# EasyEDA schematic Schematics.json
TITLE: Esp32 Radar Scanner; REV: 1.0; Date: 2026-01-19; Sheet: 1/1; Drawn By: mohammadsarfaraz
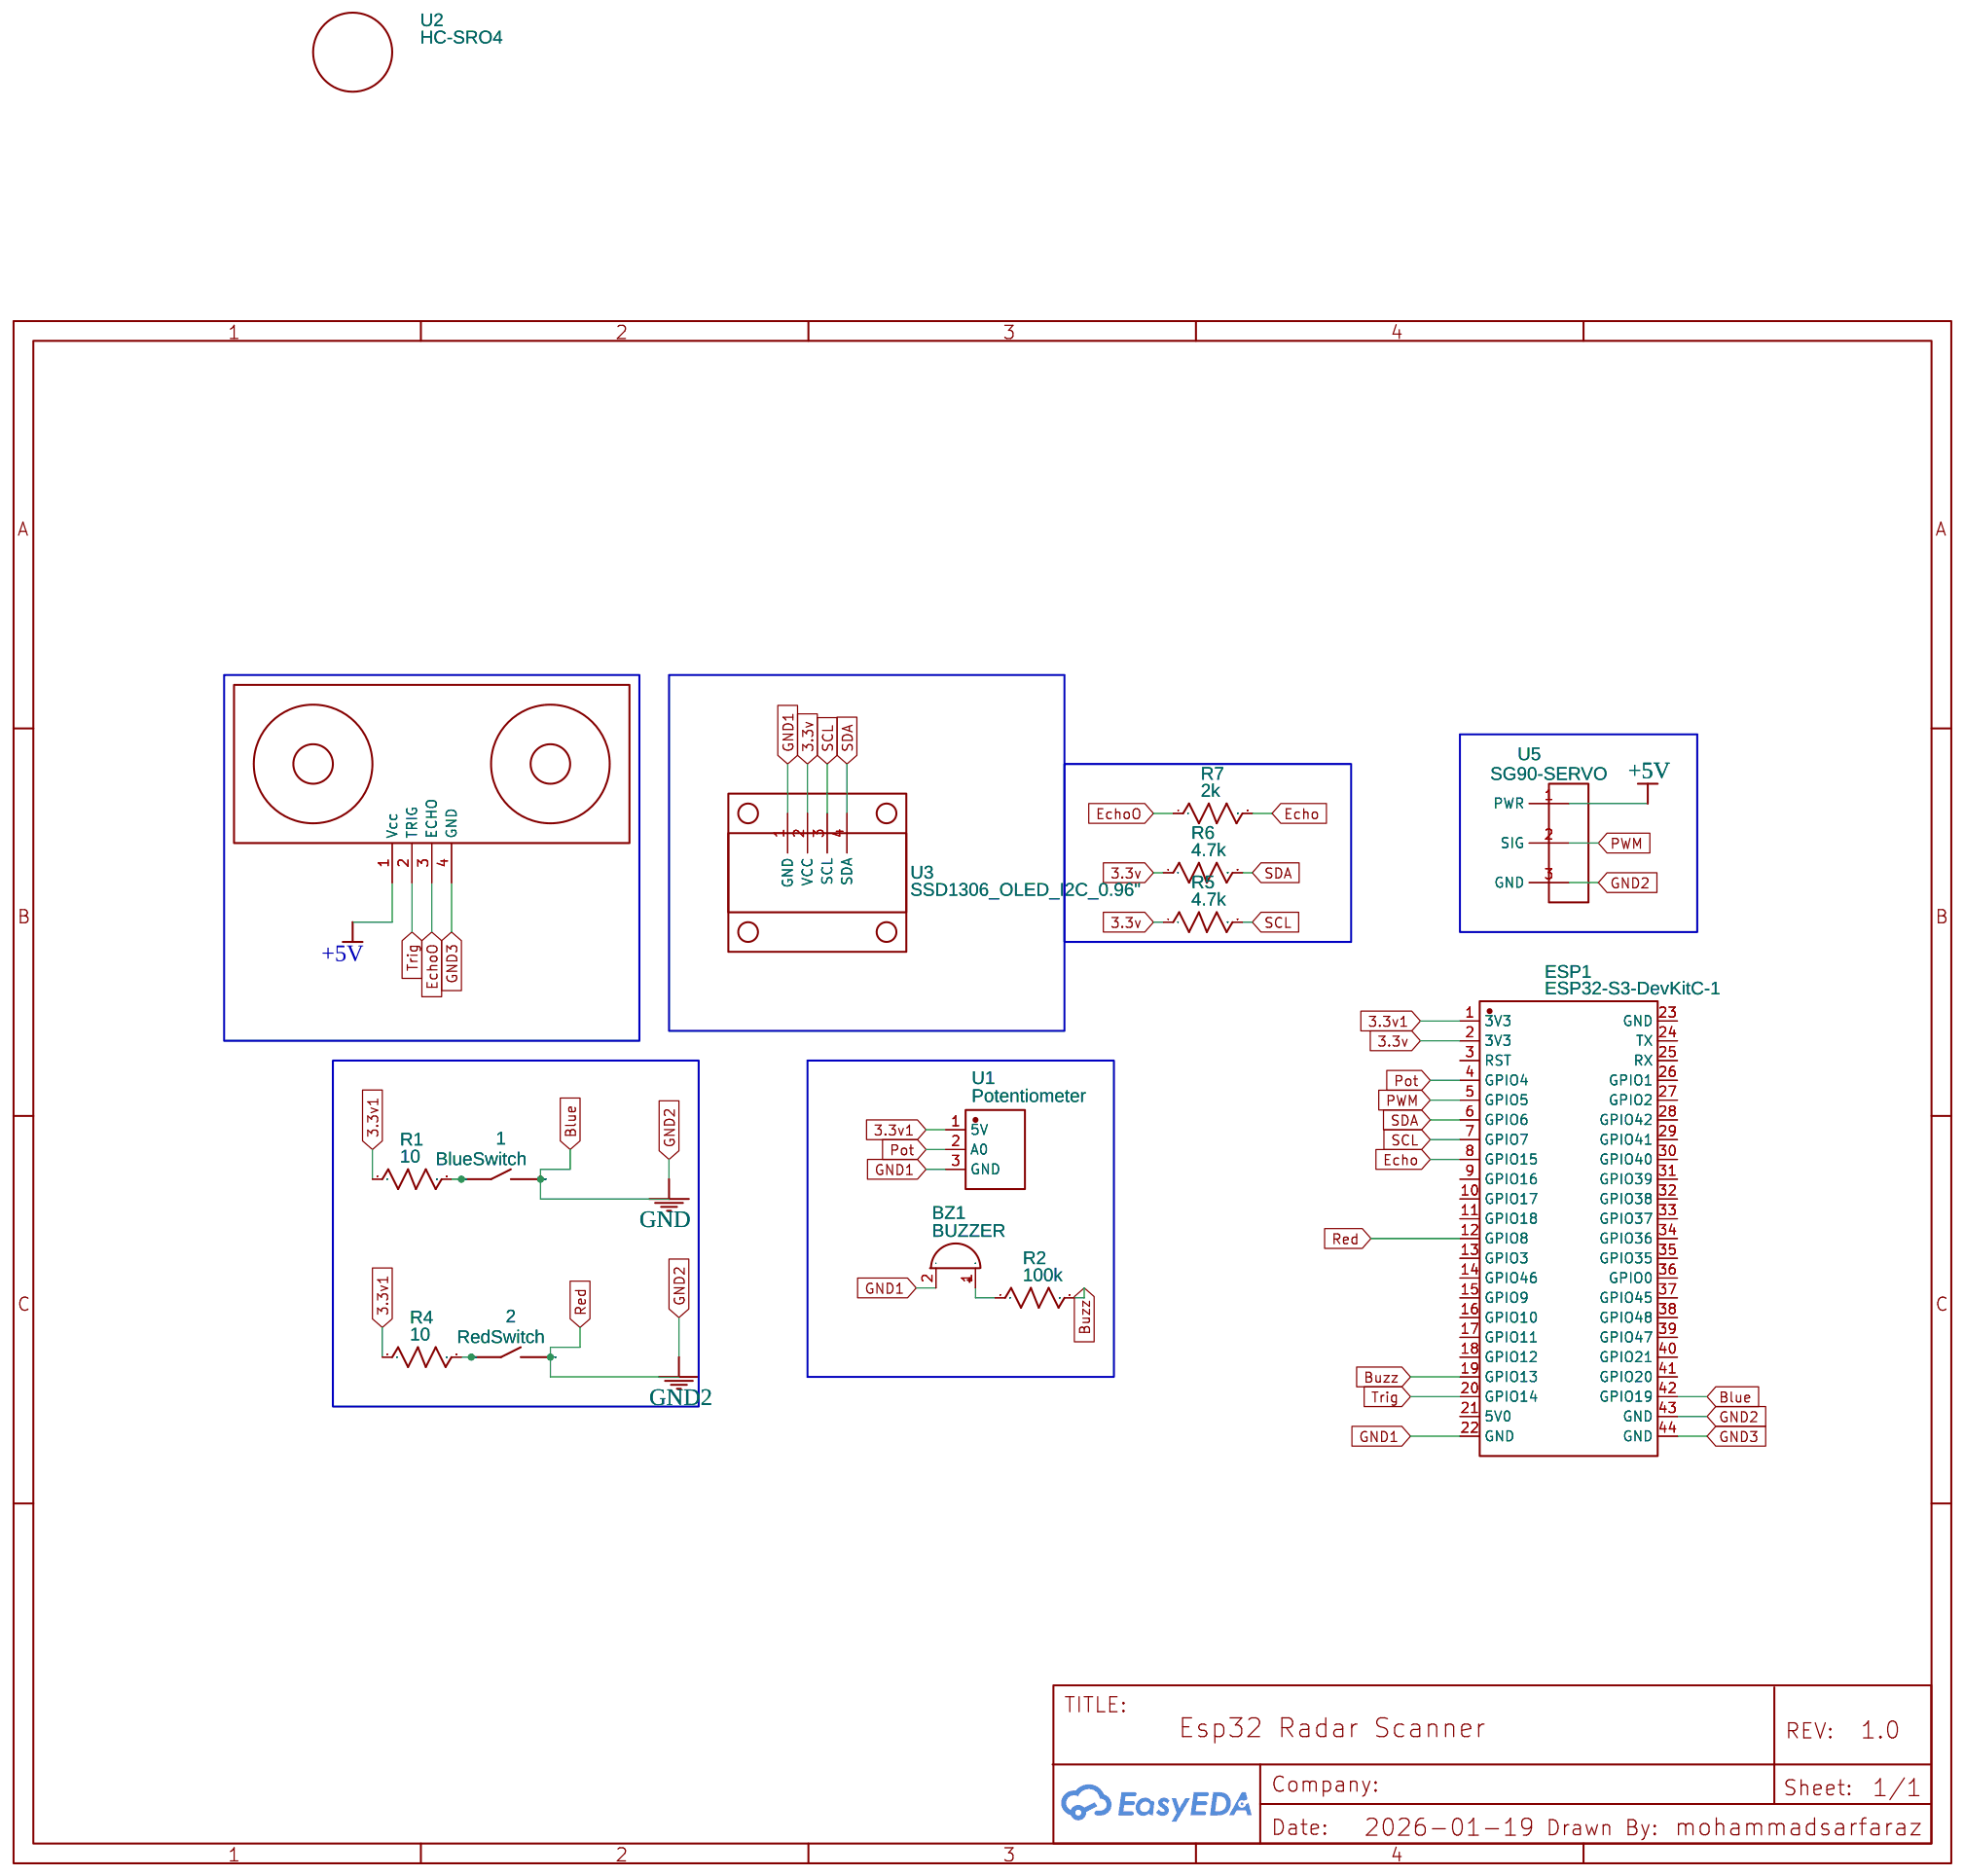
[diagram p0: schematic sheet]

## Parts
1  BlueSwitch  [SMD-4.5X4.5-TACTILE-PUSH-BUTTON]
2  RedSwitch  [SMD-4.5X4.5-TACTILE-PUSH-BUTTON]
BZ1  BUZZER  [BUZZER_BEEPER:BUZZER_12X9.5RM7.6]
ESP1  ESP32-S3-DevKitC-1  [ESP32-S3-DEVKITC-1]
R1  10  [R0603]
R2  100k  [R0603]
R4  10  [R0603]
R5  4.7k  [R0603]
R6  4.7k  [R0603]
R7  2k  [R0603]
U1  Potentiometer  [POTENTIOMETER10K]
U2  HC-SRO4
U3  SSD1306_OLED_I2C_0.96"  [SSD1306_OLED_I2C_0.96"]
U5  SG90-SERVO  [SG90-SERVO]

## Library data of the parts
1 2 = 4.5X4.5-SMD-TACTILE-SWITCH: Contributor: Aman Verma
BZ1 = BUZZER 12X9.5 FATHBOARD: Symbol: Device_Buzzer; Device: Device_Buzzer; Add into BOM: yes; Convert to PCB: yes; Origin Footprint: Buzzer_Beeper:Buzzer_12x9.5RM7.6; Contributor: myboomybott
ESP1 = ESP32-S3-DevKitC-1: Contributor: jrbynum
R1 R2 R4-R7 = R_0603_US: Contributor: LCEDA_Lib
U1 = Potentiometer: Contributor: eileen03
U2 = HC-SRO4: Contributor: lusc23067
U3 = SSD1306_OLED_I2C_0.96": Contributor: peterch84
U5 = SG90-SERVO: Contributor: theonegareth

## Nets
3.3v: ESP1.2(3V3) R5.1 R6.1 U3.2(VCC)
3.3v1: ESP1.1(3V3) R1.1 R4.1 U1.1(5V)
+5V: U2.1(Vcc) U5.1(PWR)
GND: ESP1.43(GND) U5.3(GND)
GND1: BZ1.2(-) ESP1.22(GND) U1.3(GND) U3.1(GND)
GND3: ESP1.44(GND) U2.4(GND)
Blue: 1.2.1(S2) 1.2.2(S2) ESP1.42(GPIO19)
Buzz: ESP1.19(GPIO13) R2.2
Echo: ESP1.8(GPIO15) R7.2
EchoO: R7.1 U2.3(ECHO)
Pot: ESP1.4(GPIO4) U1.2(A0)
PWM: ESP1.5(GPIO5) U5.2(SIG)
Red: 2.2.1(S2) 2.2.2(S2) ESP1.12(GPIO8)
SCL: ESP1.7(GPIO7) R5.2 U3.3(SCL)
SDA: ESP1.6(GPIO6) R6.2 U3.4(SDA)
Trig: ESP1.20(GPIO14) U2.2(TRIG)
Net-(1-1.1): 1.1.1(S1) 1.1.2(S1) R1.2
Net-(2-1.1): 2.1.1(S1) 2.1.2(S1) R4.2
Net-(BZ1-1): BZ1.1(+) R2.1

Not connected (* = marked no-connect by the designer): ESP1 3(RST) 9(GPIO16) 10(GPIO17) 11(GPIO18) 13(GPIO3) 14(GPIO46) 15(GPIO9) 16(GPIO10) 17(GPIO11) 18(GPIO12) 21(5V0) 23(GND) 24(TX) 25(RX) 26(GPIO1) 27(GPIO2) 28(GPIO42) 29(GPIO41) 30(GPIO40) 31(GPIO39) 32(GPIO38) 33(GPIO37) 34(GPIO36) 35(GPIO35) 36(GPIO0) 37(GPIO45) 38(GPIO48) 39(GPIO47) 40(GPIO21) 41(GPIO20)
